# EAGLE design Bind-Board-V1-0 (EAGLE 7.3.0)
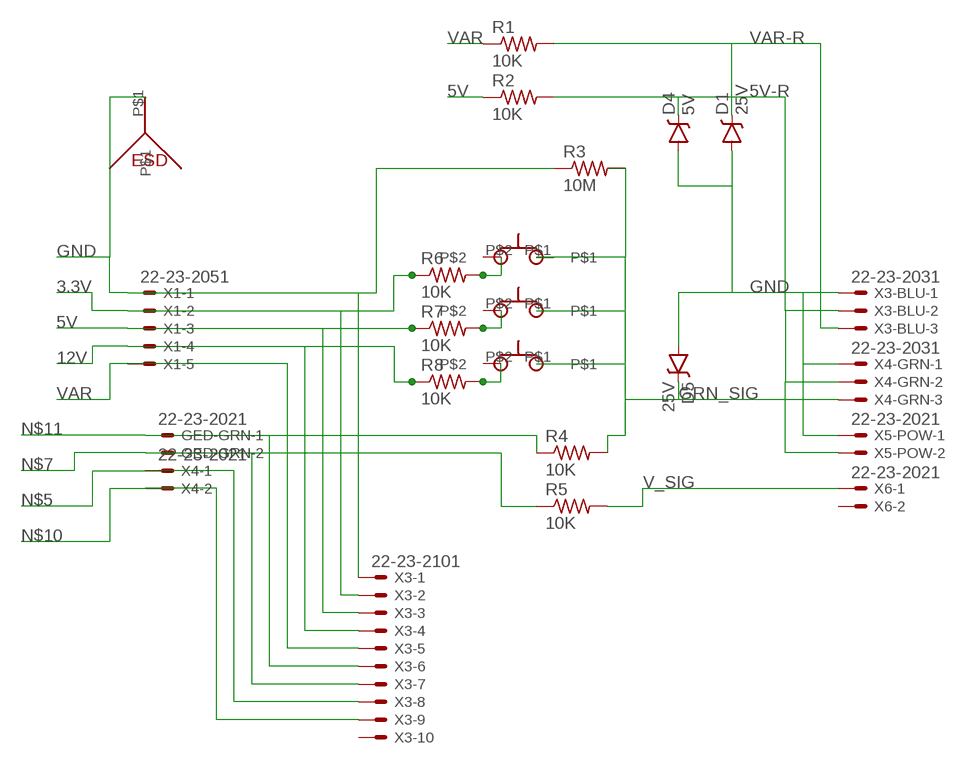
[diagram p0: schematic, sheet 1]

## Parts
D1  25V  ZLLS500ZLLS500  [SOT23-3]
D4  5V  ZLLS500ZLLS500  [SOT23-3]
D5  25V  ZLLS500ZLLS500  [SOT23-3]
GED-GRN  22-23-2021  [22-23-2021]
R1  10K  R-US_M2012  [M2012]
R2  10K  R-US_M2012  [M2012]
R3  10M  R-US_M2012  [M2012]
R4  10K  R-US_M2012  [M2012]
R5  10K  R-US_M2012  [M2012]
R6  10K  R-US_M2012  [M2012]
R7  10K  R-US_M2012  [M2012]
R8  10K  R-US_M2012  [M2012]
U$1  PUSH-BUTTON-SWITCH  [PUSH-BUTTON-SWITCH]
U$2  PUSH-BUTTON-SWITCH  [PUSH-BUTTON-SWITCH]
U$3  PUSH-BUTTON-SWITCH  [PUSH-BUTTON-SWITCH]
U$4  ESD-STAR  [ESD-STAR]
X1  22-23-2051  [22-23-2051]
X3  22-23-2101  [22-23-2101]
X3-BLU  22-23-2031  [22-23-2031]
X4  22-23-2021  [22-23-2021]
X4-GRN  22-23-2031  [22-23-2031]
X5-POW  22-23-2021  [22-23-2021]
X6  22-23-2021  [22-23-2021]

## Nets
3.3V: R6.1 X1.2 X3.2
5V: R2.1 R7.1 X1.3 X3.3
5V-R: D4.3(C) R2.2 X3-BLU.2 X4-GRN.2 X5-POW.2
12V: R8.1 X1.4 X3.4
GND: D1.1(A) D4.1(A) D5.1(A) R3.1 U$4.P$1 X1.1 X3-BLU.1 X3.1 X4-GRN.1 X5-POW.1
GRN_SIG: D5.3(C) R3.2 R4.2 U$1.P$1 U$2.P$1 U$3.P$1 X4-GRN.3
N$1: R7.2 U$2.P$2
N$2: R6.2 U$1.P$2
N$3: R8.2 U$3.P$2
N$5: X3.8 X4.1
N$7: GED-GRN.2 R5.1 X3.7
N$10: X3.9 X4.2
N$11: GED-GRN.1 R4.1 X3.6
V_SIG: R5.2 X6.1
VAR: R1.1 X1.5 X3.5
VAR-R: D1.3(C) R1.2 X3-BLU.3
Unconnected: X3.10 X6.2

## Library data of the parts
D1 D4 D5 = SparkFun-DiscreteSemi:ZLLS500: 700mA 40V SOT-23 Schottky; PROD_ID: DIO-08411; VALUE: ZLLS500
GED-GRN X4 X5-POW X6 = con-molex:22-23-2021: .100" (2.54mm) Center Header - 2 Pin; MF: MOLEX; MPN: 22-23-2021; OC_FARNELL: 1462926; OC_NEWARK: 25C3832
R1-R8 = resistor:R-US_: RESISTOR, American symbol
U$1-U$3 = untitled:PUSH-BUTTON-SWITCH
U$4 = untitled:ESD-STAR
X1 = con-molex:22-23-2051: .100" (2.54mm) Center Header - 5 Pin; MF: MOLEX; MPN: 22-23-2051; OC_FARNELL: 1462952; OC_NEWARK: 38C9178
X3 = con-molex:22-23-2101: .100" (2.54mm) Center Header - 10 Pin; MF: MOLEX; MPN: 22-23-2101; OC_FARNELL: 1756828; OC_NEWARK: 94C0765
X3-BLU X4-GRN = con-molex:22-23-2031: .100" (2.54mm) Center Header - 3 Pin; MF: MOLEX; MPN: 22-23-2031; OC_FARNELL: 1462950; OC_NEWARK: 30C0862

## Board
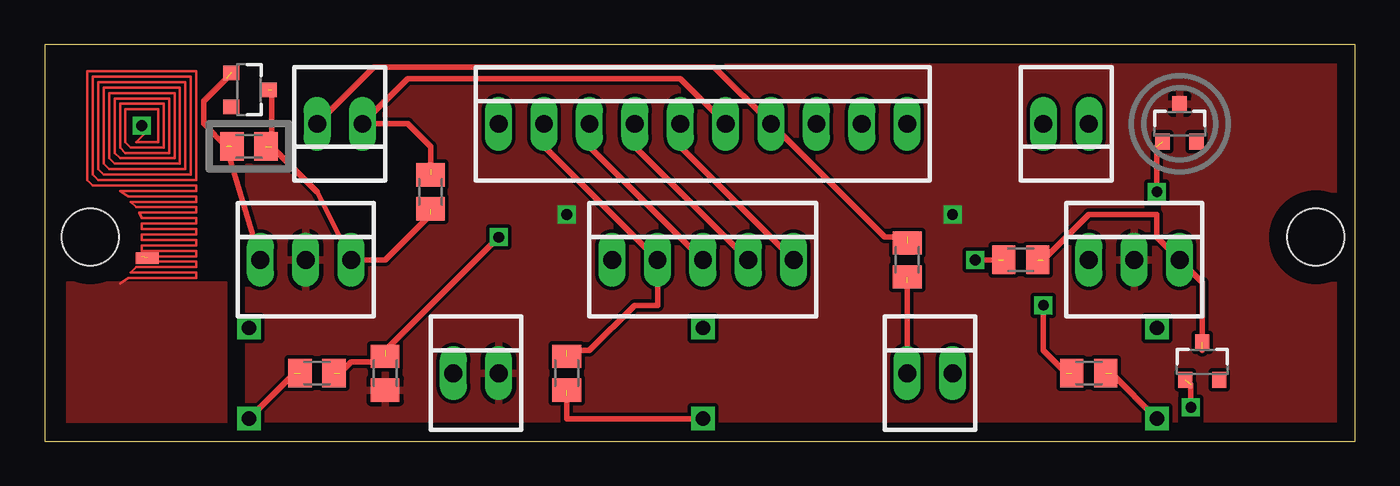
[diagram p1: board, top side]
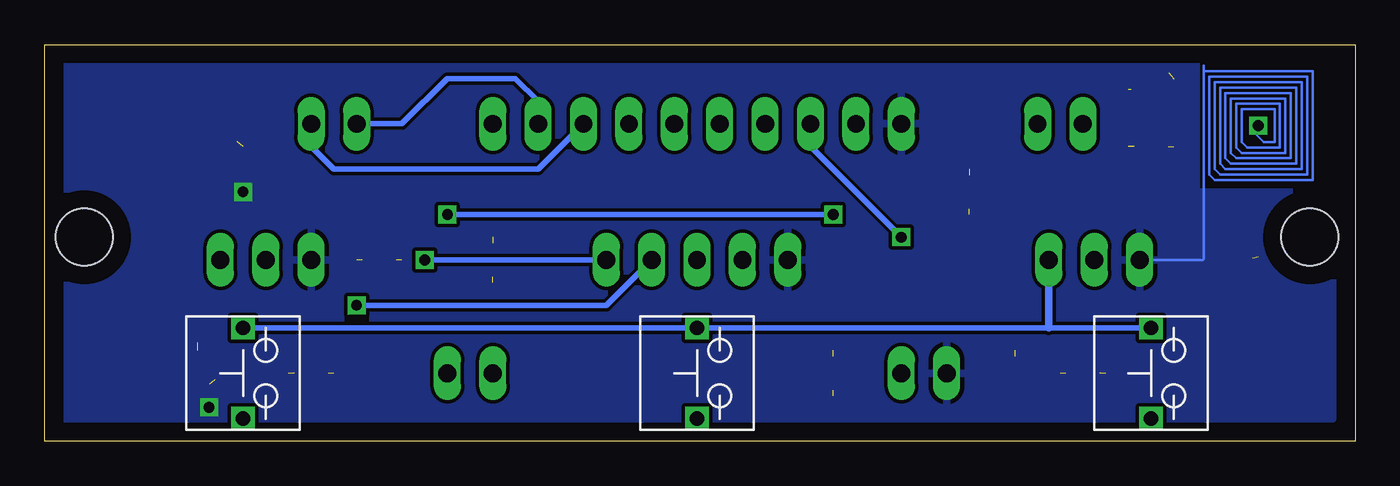
[diagram p2: board, bottom side, seen from below]

Size 73.33 x 22.21 mm. Coordinates in mm from the lower left corner, seen from the top.
Outline: 0,0 73.33,0 73.33,22.21 0,22.21 0,0
Copper layers (1*16): Top 0.035mm / dielectric 1.5mm / Bottom 0.035mm
Design rules "default": minimum track width 10mil, minimum drill 24mil, track to track 8mil, track to pad 8mil, pad to pad 8mil, via to via 8mil, smd to smd 8mil, copper to edge 40mil, drill to drill 8mil, minimum pad ring 10mil, minimum via ring 8mil, stop-mask expansion 4mil, vias tented up to drill 0mil, thermal gap 10mil
Holes 3.2 mm at 2.54,11.43 71.12,11.43

### Footprints (pad centres in the part's own frame; a part is rotated, then mirrored left to right if it is on the bottom)
SOT23-3 = smd 0.8 x 0.9: 1 -0.95,-1; 2 0.95,-1; 3 0,1.1
22-23-2021 = drill 1 long: 1 -1.27,0; 2 1.27,0
M2012 = smd 1.3 x 1.6: 1 -0.95,0; 2 0.95,0
PUSH-BUTTON-SWITCH = drill 0.8 square: P$1 2.54,0; P$2 -2.54,0
ESD-STAR = smd 1.27 x 0.635: P$1 0,5.08
22-23-2051 = drill 1 long: 1 -5.08,0; 2 -2.54,0; 3 0,0; 4 2.54,0; 5 5.08,0
22-23-2101 = drill 1 long: 1 -11.43,0; 2 -8.89,0; 3 -6.35,0; 4 -3.81,0; 5 -1.27,0; 6 1.27,0; 7 3.81,0; 8 6.35,0; 9 8.89,0; 10 11.43,0
22-23-2031 = drill 1 long: 1 -2.54,0; 2 0,0; 3 2.54,0

### Placement (x,y rotation side)
D1  64.77,4.45 0 top
D4  63.5,17.78 0 top
D5  11.43,19.68 270 top
GED-GRN  16.51,17.78 180 top
R1  54.61,10.16 0 top
R2  19.05,3.81 270 top
R3  11.43,16.51 0 top
R4  21.59,13.97 270 top
R5  48.26,10.16 270 top
R6  29.21,3.81 270 top
R7  15.24,3.81 180 top
R8  58.42,3.81 0 top
U$1  36.83,3.81 90 bottom
U$2  11.43,3.81 90 bottom
U$3  62.23,3.81 90 bottom
U$4  5.74,5.18 0 top
X1  36.83,10.16 0 top
X3  36.83,17.78 0 top
X3-BLU  60.96,10.16 0 top
X4  57.15,17.78 180 top
X4-GRN  14.61,10.16 0 top
X5-POW  24.13,3.81 0 top
X6  49.53,3.81 0 top

### Tracks (layer width: path | path; a pad name or v marks a point on that pad's centre or on a via)
3.3V  (1 unrouted)
  Top 0.305: 29.21,5.08 30.48,5.08 33.02,7.62 34.29,7.62 X1.2 27.94,16.51 X3.2
5V  (via drill 0.6)  (2 unrouted)
  Top 0.305: X3.3 30.48,16.51 X1.3 | 16.51,3.81 17.14,4.45 19.05,4.45 19.05,5.08 v25.4,11.43
  Bottom 0.305: v25.4,11.43 30.48,16.51 X3.3
5V-R  (via drill 0.6)
  Bottom 0.305: v29.21,12.7 v50.8,12.7
  pour Top: 11.43,1.27 11.43,20.95 72.39,20.95 72.39,1.27
12V  (via drill 0.6)  (1 unrouted)
  Top 0.305: X3.4 33.02,16.51 X1.4 | v55.88,7.62 55.88,5.08 57.15,3.81
  Bottom 0.305: X1.4 41.91,7.62 v55.88,7.62
GND  (via drill 0.6)  (5 unrouted)
  Top 0.152: v5.44,17.68 5.74,17.37 5.13,16.76 6.35,16.76 6.35,18.59 4.52,18.59 4.52,16.76 4.83,16.46 6.65,16.46 6.65,18.9 4.22,18.9 4.22,16.46 4.52,16.15 6.96,16.15 6.96,19.2 3.91,19.2 3.91,16.15 4.22,15.85 7.26,15.85 7.26,19.51 3.61,19.51 3.61,15.85 3.91,15.54 7.57,15.54 7.57,19.81 3.3,19.81 3.3,15.54 3.61,15.24 7.87,15.24 7.87,20.12 3,20.12 3,15.24 3.3,14.94 8.18,14.94 8.18,20.42 2.69,20.42 2.69,14.94 3,14.63 8.48,14.63 8.48,20.73 2.39,20.73 2.39,14.63 2.69,14.33 8.48,14.33 8.48,14.02 4.22,14.02 4.67,13.72 8.48,13.72 8.48,13.41 4.83,13.41 5.13,13.11 8.48,13.11 8.48,12.8 5.28,12.8 5.44,12.5 8.48,12.5 8.48,12.19 5.44,12.19 5.44,11.89 8.48,11.89 8.48,11.58 5.44,11.58 5.44,11.28 8.48,11.28 8.48,10.97 5.44,10.97 5.44,10.67 8.48,10.67 8.48,10.36 5.44,10.36 5.28,10.06 8.48,10.06 8.48,9.75 5.13,9.75 4.83,9.45 8.48,9.45 8.48,9.14 4.67,9.14 4.22,8.84
  Top 0.305: v64.14,1.91 64.14,3.17 | v62.23,13.97 62.23,16.51 | X4-GRN.1 10.16,16.51 8.89,17.78 8.89,19.05 10.16,20.32
  Bottom 0.152: X4-GRN.1 8.53,10.16 8.48,10.21 8.48,20.73 | 8.48,20.73 8.48,21.03 | 8.48,20.73 2.39,20.73 2.39,14.63 7.87,14.63 8.18,14.94 8.18,20.42 2.69,20.42 2.69,14.94 7.57,14.94 7.87,15.24 7.87,20.12 3,20.12 3,15.24 7.26,15.24 7.57,15.54 7.57,19.81 3.3,19.81 3.3,15.54 6.96,15.54 7.26,15.85 7.26,19.51 3.61,19.51 3.61,15.85 6.65,15.85 6.96,16.15 6.96,19.2 3.91,19.2 3.91,16.15 6.35,16.15 6.65,16.46 6.65,18.9 4.22,18.9 4.22,16.46 6.04,16.46 6.35,16.76 6.35,18.59 4.52,18.59 4.52,16.76 5.13,16.76 5.74,17.37 v5.44,17.68
  pour Bottom: 72.39,1.27 1.27,1.27 1.27,13.97 8.89,13.97 8.89,21.59 72.39,21.59
  pour Top: 1.27,0.64 1.27,8.89 10.16,8.89 10.16,0.64
GRN_SIG  (3 unrouted)
  Top 0.305: 21.59,12.7 19.05,10.16 X4-GRN.3 15.24,13.97 12.7,16.51 12.7,19.68
  Bottom 0.305: U$2.P$1 17.14,6.35 U$1.P$1 U$3.P$1
  Bottom 0.406: X4-GRN.3 17.14,6.35
N$1  (1 unrouted)
  Top 0.305: U$2.P$2 13.97,3.81
N$2  (1 unrouted)
  Top 0.305: 29.21,2.54 29.21,1.27 U$1.P$2
N$3  (1 unrouted)
  Top 0.305: U$3.P$2 59.69,3.81
N$5
  Bottom 0.305: X4.1 58.42,16.51 57.15,15.24 45.72,15.24 X3.8
N$7  (1 unrouted)
  Top 0.305: GED-GRN.2 18.41,20.95 37.46,20.95 X3.7 46.99,11.43 48.26,11.43
N$10
  Bottom 0.305: X4.2 53.34,17.78 50.8,20.32 46.99,20.32 45.72,19.05 X3.9
N$11  (1 unrouted)
  Top 0.305: X3.6 35.56,20.32 20.32,20.32 GED-GRN.1 20.32,17.78 21.59,16.51 21.59,15.24
V_SIG  (1 unrouted)
  Top 0.305: X6.1 48.26,8.89
VAR  (via drill 0.6)  (1 unrouted)
  Top 0.305: v52.07,10.16 53.34,10.16 | X3.5 35.56,16.51 X1.5
  Bottom 0.305: X1.5 v52.07,10.16
VAR-R  (2 unrouted)
  Top 0.305: 64.77,5.08 64.77,8.89 X3-BLU.3 62.23,11.43 62.23,12.7 58.42,12.7 55.88,10.16

### Text on the board
tDocu: 5
200bmp: © 2015 | Bind Board V1.0 | FenStar.co/p/2015/BND-BRD